# Altium schematic sheet Gate Driver.SchDoc
size 406 x 304 mm; SheetNumber: 2; SheetTotal: 4
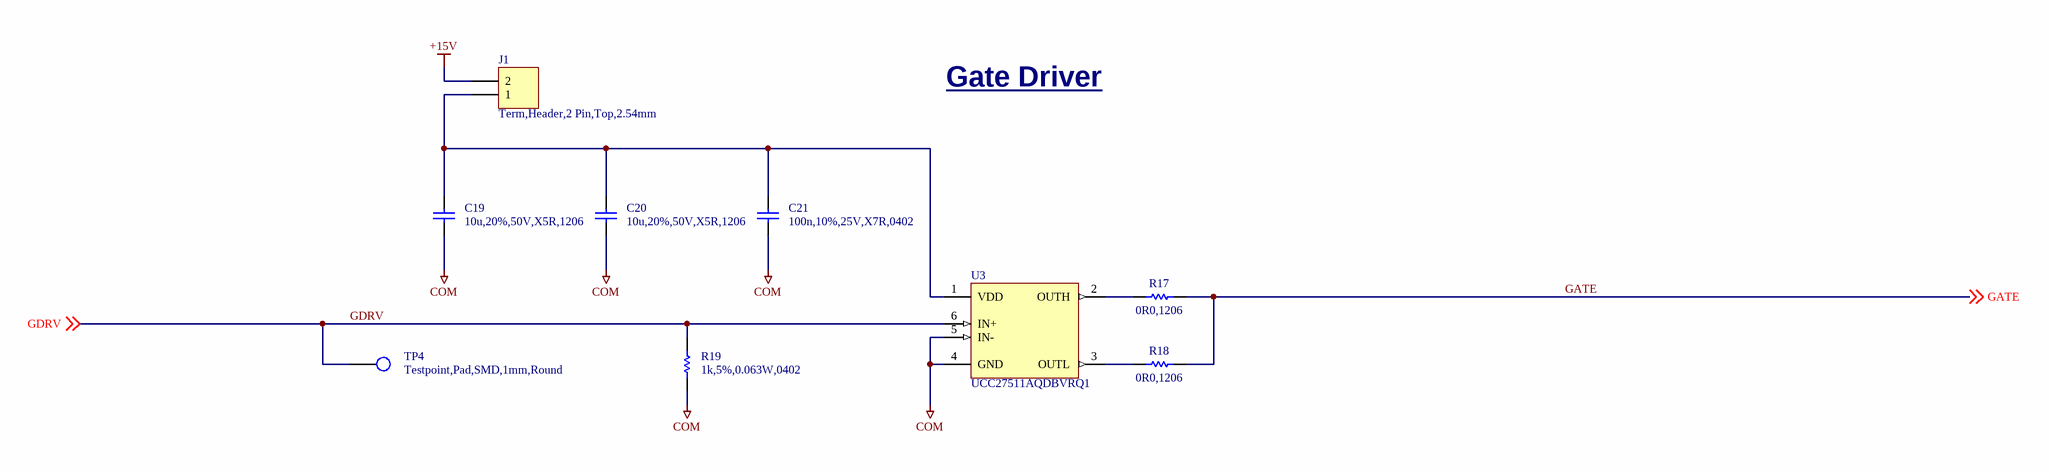
[diagram p0: Gate Driver.SchDoc]

## Parts
C19  10u,20%,50V,X5R,1206  [CAPC3216X16N]
C20  10u,20%,50V,X5R,1206  [CAPC3216X16N]
C21  100n,10%,25V,X7R,0402  [CAPC1005X06N]
J1  Term,Header,2 Pin,Top,2.54mm  [WURTH_61300211121]
R17  0R0,1206  [RESC3216X06N]
R18  0R0,1206  [RESC3216X06N]
R19  1k,5%,0.063W,0402  [RESC1005X04N]
TP4  Testpoint,Pad,SMD,1mm,Round  [TP100]
U3  UCC27511AQDBVRQ1  [SOTFL95P260X145-6]

## Nets
+15V: J1.2
COM: C19.1 C20.1 C21.1 R19.1 U3.4(GND) U3.5(IN-)
GATE: R17.2 R18.2 ; off-sheet GATE
GDRV: R19.2 TP4.1(TP) U3.6(IN+) ; off-sheet GDRV
NetC19_2: C19.2 C20.2 C21.2 J1.1 U3.1(VDD)
NetR17_1: R17.1 U3.2(OUTH)
NetR18_1: R18.1 U3.3(OUTL)

## Notes on the sheet
- Gate Driver
- Rev
- Sheet Name:
- Date:
- Sheet
- Designer:
- of

## Library data of the parts
C19 C20 = CAP,Cer,10uF,50VDC,X5R,1206: 10ï¿½F ï¿½20% 50V Ceramic Capacitor X5R 1206 (3216 Metric); Manufacturer 1: Samsung Electro-Mechanics; Manufacturer 1 Part Number: CL31A106MBHNNNE; Vendor 1 Part Number: 1276-6736-1-ND; Vendor 1: Digikey; Part Name: CAP,Cer,10uF,50VDC,X5R,1206; CreatedBy: Judd Foster; HelpURL: https://www.samsungsem.com/resources/file/global/support/product_catalog/MLCC.pdf; Value: 10u
C21 = CAP,Cer,100nF,10%,25V,X7R,0402: 0.1ï¿½F ï¿½10% 25V Ceramic Capacitor X7R 0402 (1005 Metric); Manufacturer 1: Murata Electronics; Manufacturer 1 Part Number: GRM155R71E104KE14J; Vendor 1 Part Number: 490-14603-1-ND; Vendor 1: DigiKey; Value: 100nF; Part Name: CAP,Cer,100nF,10%,25V,X7R,0402; CreatedBy: Judd Foster; HelpURL: https://search.murata.co.jp/Ceramy/image/img/A01X/G101/ENG/GRM155R71E104KE14-01.pdf
J1 = Term,Header,2 Pin,Top,2.54mm: Connector Header Through Hole 2 position 0.100" (2.54mm); Manufacturer 1: WÃ¼rth Elektronik; Manufacturer 1 Part Number: 61300211121; Vendor 1 Part Number: 732-5315-ND; Vendor 1: DigiKey; Part Name: Term,Header,2 Pin,Top,2.54mm; CreatedBy: Judd Foster; HelpURL: https://www.we-online.com/components/products/datasheet/61300211121.pdf
R17 R18 = RES,0R0,1206: 0 Ohms Jumper Chip Resistor 1206 (3216 Metric) Automotive AEC-Q200 Thick Film; Manufacturer 1: Stackpole Electronics Inc; Manufacturer 1 Part Number: RMCF1206ZT0R00; Vendor 1 Part Number: RMCF1206ZT0R00CT-ND; Vendor 1: Digikey; Value: 0R; Part Name: RES,0R0,1206; CreatedBy: Judd Foster; HelpURL: https://www.seielect.com/catalog/sei-rmcf_rmcp.pdf
R19 = RES,1k,5%,0.063W,0402: 1 kOhms ï¿½5% 0.063W, 1/16W Chip Resistor 0402 (1005 Metric) Automotive AEC-Q200 Thick Film; Manufacturer 1: Stackpole Electronics Inc; Manufacturer 1 Part Number: RMCF0402JT1K00; Vendor 1 Part Number: RMCF0402JT1K00CT-ND; Vendor 1: DIgikey; Part Name: RES,1k,5%,0.063W,0402; CreatedBy: Judd Foster; HelpURL: https://www.seielect.com/catalog/sei-rmcf_rmcp.pdf; Value: 1k
TP4 = Testpoint,Pad,SMD: PCB Testpoint 1mm Round; Part Name: Testpoint,Pad,SMD; CreatedBy: Judd Foster; HelpURL: N/A; Manufacturer 1: N/A; Manufacturer 1 Part Number: N/A; Vendor 1: N/A; Vendor 1 Part Number: N/A
U3 = UCC27511AQDBVRQ1: Gate Drivers Sngl-Ch high-Spd Low-Side Gate Driver; Manufacturer 1: Texas Instruments; Vendor 1 Part Number: 595-UCC27511AQDBVRQ1; Vendor 1: Mouser; Part Name: UCC27511AQDBVRQ1; CreatedBy: Judd Foster; HelpURL: https://www.ti.com/general/docs/suppproductinfo.tsp?distId=26&gotoUrl=https://www.ti.com/lit/gpn/ucc27511a-q1; Manufacturer 1 Part Number: UCC27511AQDBVRQ1